# EAGLE schematic Board (EAGLE 9.2.2)
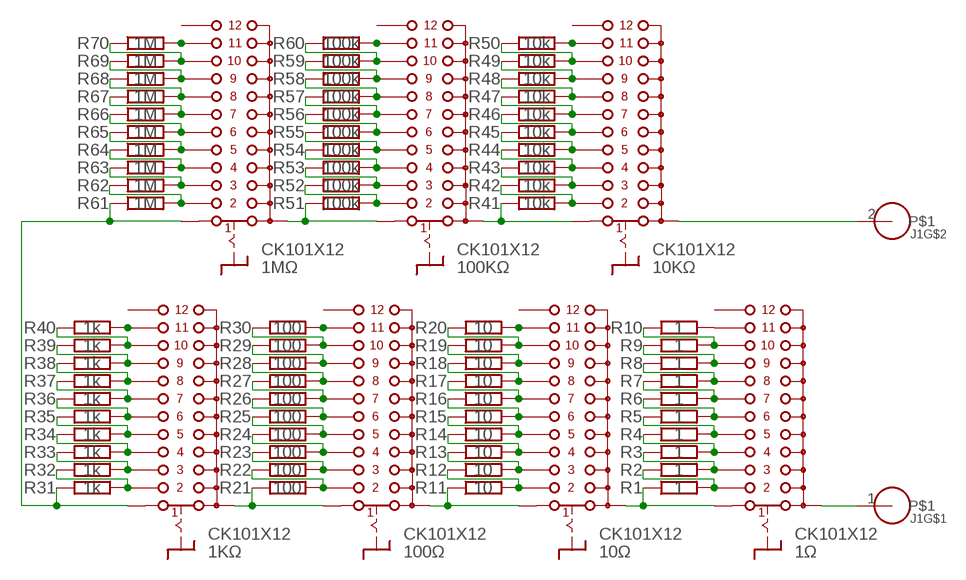
[diagram p0: schematic, sheet 1]

## Parts
1KΩ  CK101X12  [CK101X12]
1MΩ  CK101X12  [CK101X12]
1Ω  CK101X12  [CK101X12]
10KΩ  CK101X12  [CK101X12]
10Ω  CK101X12  [CK101X12]
100KΩ  CK101X12  [CK101X12]
100Ω  CK101X12  [CK101X12]
J1  MOLEX-1X2  [MOLEX-1X2_LOCK]
R1  1  R-EU  [0207/2V]
R2  1  R-EU  [0207/2V]
R3  1  R-EU  [0207/2V]
R4  1  R-EU  [0207/2V]
R5  1  R-EU  [0207/2V]
R6  1  R-EU  [0207/2V]
R7  1  R-EU  [0207/2V]
R8  1  R-EU  [0207/2V]
R9  1  R-EU  [0207/2V]
R10  1  R-EU  [0207/2V]
R11  10  R-EU  [0207/2V]
R12  10  R-EU  [0207/2V]
R13  10  R-EU  [0207/2V]
R14  10  R-EU  [0207/2V]
R15  10  R-EU  [0207/2V]
R16  10  R-EU  [0207/2V]
R17  10  R-EU  [0207/2V]
R18  10  R-EU  [0207/2V]
R19  10  R-EU  [0207/2V]
R20  10  R-EU  [0207/2V]
R21  100  R-EU  [0207/2V]
R22  100  R-EU  [0207/2V]
R23  100  R-EU  [0207/2V]
R24  100  R-EU  [0207/2V]
R25  100  R-EU  [0207/2V]
R26  100  R-EU  [0207/2V]
R27  100  R-EU  [0207/2V]
R28  100  R-EU  [0207/2V]
R29  100  R-EU  [0207/2V]
R30  100  R-EU  [0207/2V]
R31  1k  R-EU  [0207/2V]
R32  1k  R-EU  [0207/2V]
R33  1k  R-EU  [0207/2V]
R34  1k  R-EU  [0207/2V]
R35  1k  R-EU  [0207/2V]
R36  1k  R-EU  [0207/2V]
R37  1k  R-EU  [0207/2V]
R38  1k  R-EU  [0207/2V]
R39  1k  R-EU  [0207/2V]
R40  1k  R-EU  [0207/2V]
R41  10k  R-EU  [0207/2V]
R42  10k  R-EU  [0207/2V]
R43  10k  R-EU  [0207/2V]
R44  10k  R-EU  [0207/2V]
R45  10k  R-EU  [0207/2V]
R46  10k  R-EU  [0207/2V]
R47  10k  R-EU  [0207/2V]
R48  10k  R-EU  [0207/2V]
R49  10k  R-EU  [0207/2V]
R50  10k  R-EU  [0207/2V]
R51  100k  R-EU  [0207/2V]
R52  100k  R-EU  [0207/2V]
R53  100k  R-EU  [0207/2V]
R54  100k  R-EU  [0207/2V]
R55  100k  R-EU  [0207/2V]
R56  100k  R-EU  [0207/2V]
R57  100k  R-EU  [0207/2V]
R58  100k  R-EU  [0207/2V]
R59  100k  R-EU  [0207/2V]
R60  100k  R-EU  [0207/2V]
R61  1M  R-EU  [0207/2V]
R62  1M  R-EU  [0207/2V]
R63  1M  R-EU  [0207/2V]
R64  1M  R-EU  [0207/2V]
R65  1M  R-EU  [0207/2V]
R66  1M  R-EU  [0207/2V]
R67  1M  R-EU  [0207/2V]
R68  1M  R-EU  [0207/2V]
R69  1M  R-EU  [0207/2V]
R70  1M  R-EU  [0207/2V]

## Nets
N$1: 1Ω.2 R1.2 R2.1
N$2: 10Ω.2 R11.2 R12.1
N$3: 10Ω.1 100Ω.A R11.1
N$4: 10Ω.3 R12.2 R13.1
N$5: 10Ω.4 R13.2 R14.1
N$6: 10Ω.5 R14.2 R15.1
N$7: 10Ω.6 R15.2 R16.1
N$8: 10Ω.7 R16.2 R17.1
N$9: 10Ω.8 R17.2 R18.1
N$10: 10Ω.9 R18.2 R19.1
N$11: 1KΩ.10 R39.2 R40.1
N$12: 1Ω.3 R2.2 R3.1
N$13: 1Ω.4 R3.2 R4.1
N$14: 1Ω.5 R4.2 R5.1
N$15: 1Ω.6 R5.2 R6.1
N$16: 10Ω.10 R19.2 R20.1
N$17: 1Ω.7 R6.2 R7.1
N$18: 1Ω.8 R7.2 R8.1
N$19: 1Ω.9 R8.2 R9.1
N$20: 1Ω.10 R9.2 R10.1
N$21: 1Ω.11 R10.2
N$22: 10Ω.11 R20.2
N$23: 100Ω.2 R21.2 R22.1
N$24: 10KΩ.1 100KΩ.A R41.1
N$25: 100Ω.3 R22.2 R23.1
N$26: 100Ω.4 R23.2 R24.1
N$27: 100Ω.5 R24.2 R25.1
N$28: 100Ω.6 R25.2 R26.1
N$29: 100Ω.7 R26.2 R27.1
N$30: 100Ω.8 R27.2 R28.1
N$31: 100Ω.9 R28.2 R29.1
N$32: 100Ω.10 R29.2 R30.1
N$33: 100Ω.11 R30.2
N$34: 1KΩ.2 R31.2 R32.1
N$35: 1Ω.1 10Ω.A R1.1
N$36: 1KΩ.3 R32.2 R33.1
N$37: 1KΩ.4 R33.2 R34.1
N$38: 1KΩ.5 R34.2 R35.1
N$39: 1KΩ.6 R35.2 R36.1
N$40: 1KΩ.7 R36.2 R37.1
N$41: 1KΩ.8 R37.2 R38.1
N$42: 1KΩ.9 R38.2 R39.1
N$43: 1KΩ.1 1MΩ.1 R31.1 R61.1
N$44: 1KΩ.11 R40.2
N$45: 10KΩ.2 R41.2 R42.1
N$46: 10KΩ.A J1.2
N$47: 10KΩ.3 R42.2 R43.1
N$48: 10KΩ.4 R43.2 R44.1
N$49: 10KΩ.5 R44.2 R45.1
N$50: 10KΩ.6 R45.2 R46.1
N$51: 10KΩ.7 R46.2 R47.1
N$52: 10KΩ.8 R47.2 R48.1
N$53: 10KΩ.9 R48.2 R49.1
N$54: 10KΩ.10 R49.2 R50.1
N$55: 10KΩ.11 R50.2
N$56: 100KΩ.2 R51.2 R52.1
N$57: 1MΩ.A 100KΩ.1 R51.1
N$58: 100KΩ.3 R52.2 R53.1
N$59: 100KΩ.4 R53.2 R54.1
N$60: 100KΩ.5 R54.2 R55.1
N$61: 100KΩ.6 R55.2 R56.1
N$62: 100KΩ.7 R56.2 R57.1
N$63: 100KΩ.8 R57.2 R58.1
N$64: 100KΩ.9 R58.2 R59.1
N$65: 100KΩ.10 R59.2 R60.1
N$66: 100KΩ.11 R60.2
N$67: 1MΩ.2 R61.2 R62.1
N$68: 1KΩ.A 100Ω.1 R21.1
N$69: 1MΩ.3 R62.2 R63.1
N$70: 1MΩ.4 R63.2 R64.1
N$71: 1MΩ.5 R64.2 R65.1
N$72: 1MΩ.6 R65.2 R66.1
N$73: 1MΩ.7 R66.2 R67.1
N$74: 1MΩ.8 R67.2 R68.1
N$75: 1MΩ.9 R68.2 R69.1
N$76: 1MΩ.10 R69.2 R70.1
N$77: 1MΩ.11 R70.2
N$81: 1Ω.A J1.1
Unconnected: 1KΩ.12 1MΩ.12 1Ω.12 10KΩ.12 10Ω.12 100KΩ.12 100Ω.12

## Library data of the parts
1KΩ 1MΩ 1Ω 10KΩ 10Ω 100KΩ 100Ω = DecadeResistanceBox:CK101X12
J1 = DecadeResistanceBox:MOLEX-1X2
R1-R70 = DecadeResistanceBox:R-EU